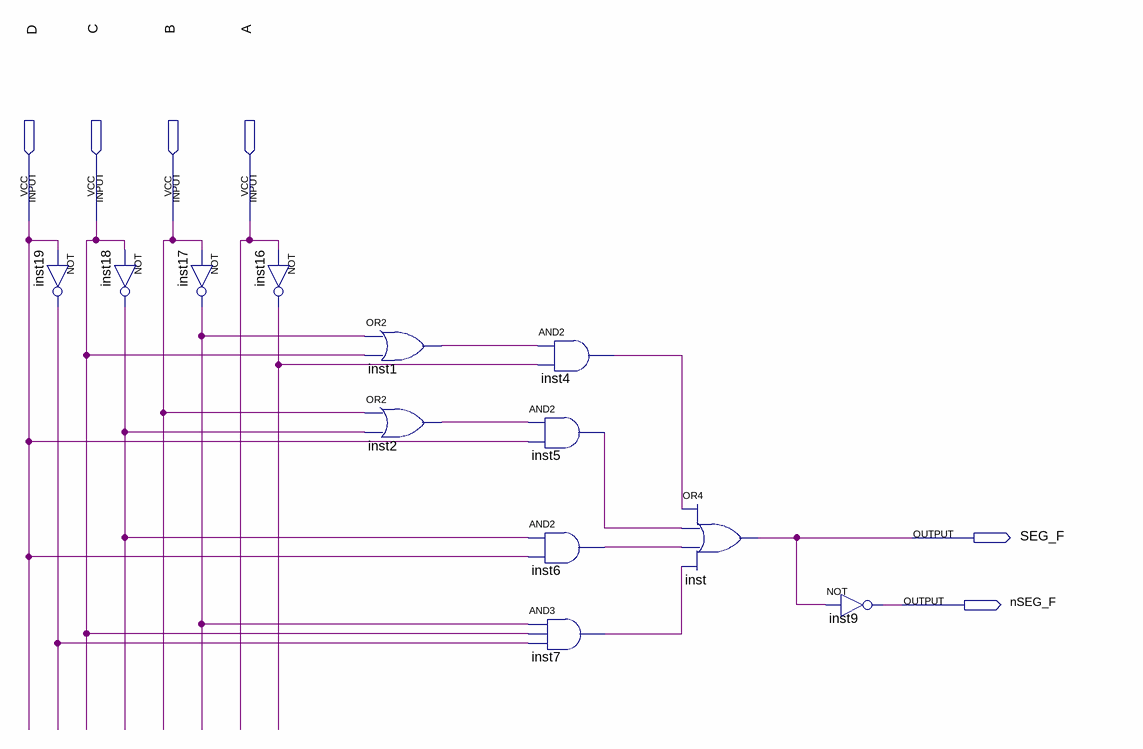
[diagram p0: schematic sheet]
// Quartus schematic SEG_F.bdf as structural Verilog: 12 symbols, 6 pins
module SEG_F (
  input  D,
  input  C,
  input  B,
  input  A,
  output SEG_F,
  output nSEG_F
);

  wire inst1_out, inst2_out, inst4_out, inst5_out, inst6_out, inst7_out, inst16_out, inst17_out, inst18_out,
       inst19_out;

  not inst19 (inst19_out, D);
  not inst18 (inst18_out, C);
  not inst17 (inst17_out, B);
  not inst16 (inst16_out, A);
  or inst1 (inst1_out, inst17_out, C);
  or inst2 (inst2_out, B, inst18_out);
  and inst4 (inst4_out, inst1_out, inst16_out);
  and inst5 (inst5_out, inst2_out, D);
  and inst6 (inst6_out, inst18_out, D);
  and inst7 (inst7_out, inst17_out, C, inst19_out);
  or inst (SEG_F, inst4_out, inst5_out, inst6_out, inst7_out);
  not inst9 (nSEG_F, SEG_F);
endmodule
